# EAGLE design hmi-lisa-encoder (EAGLE 9.6.2)
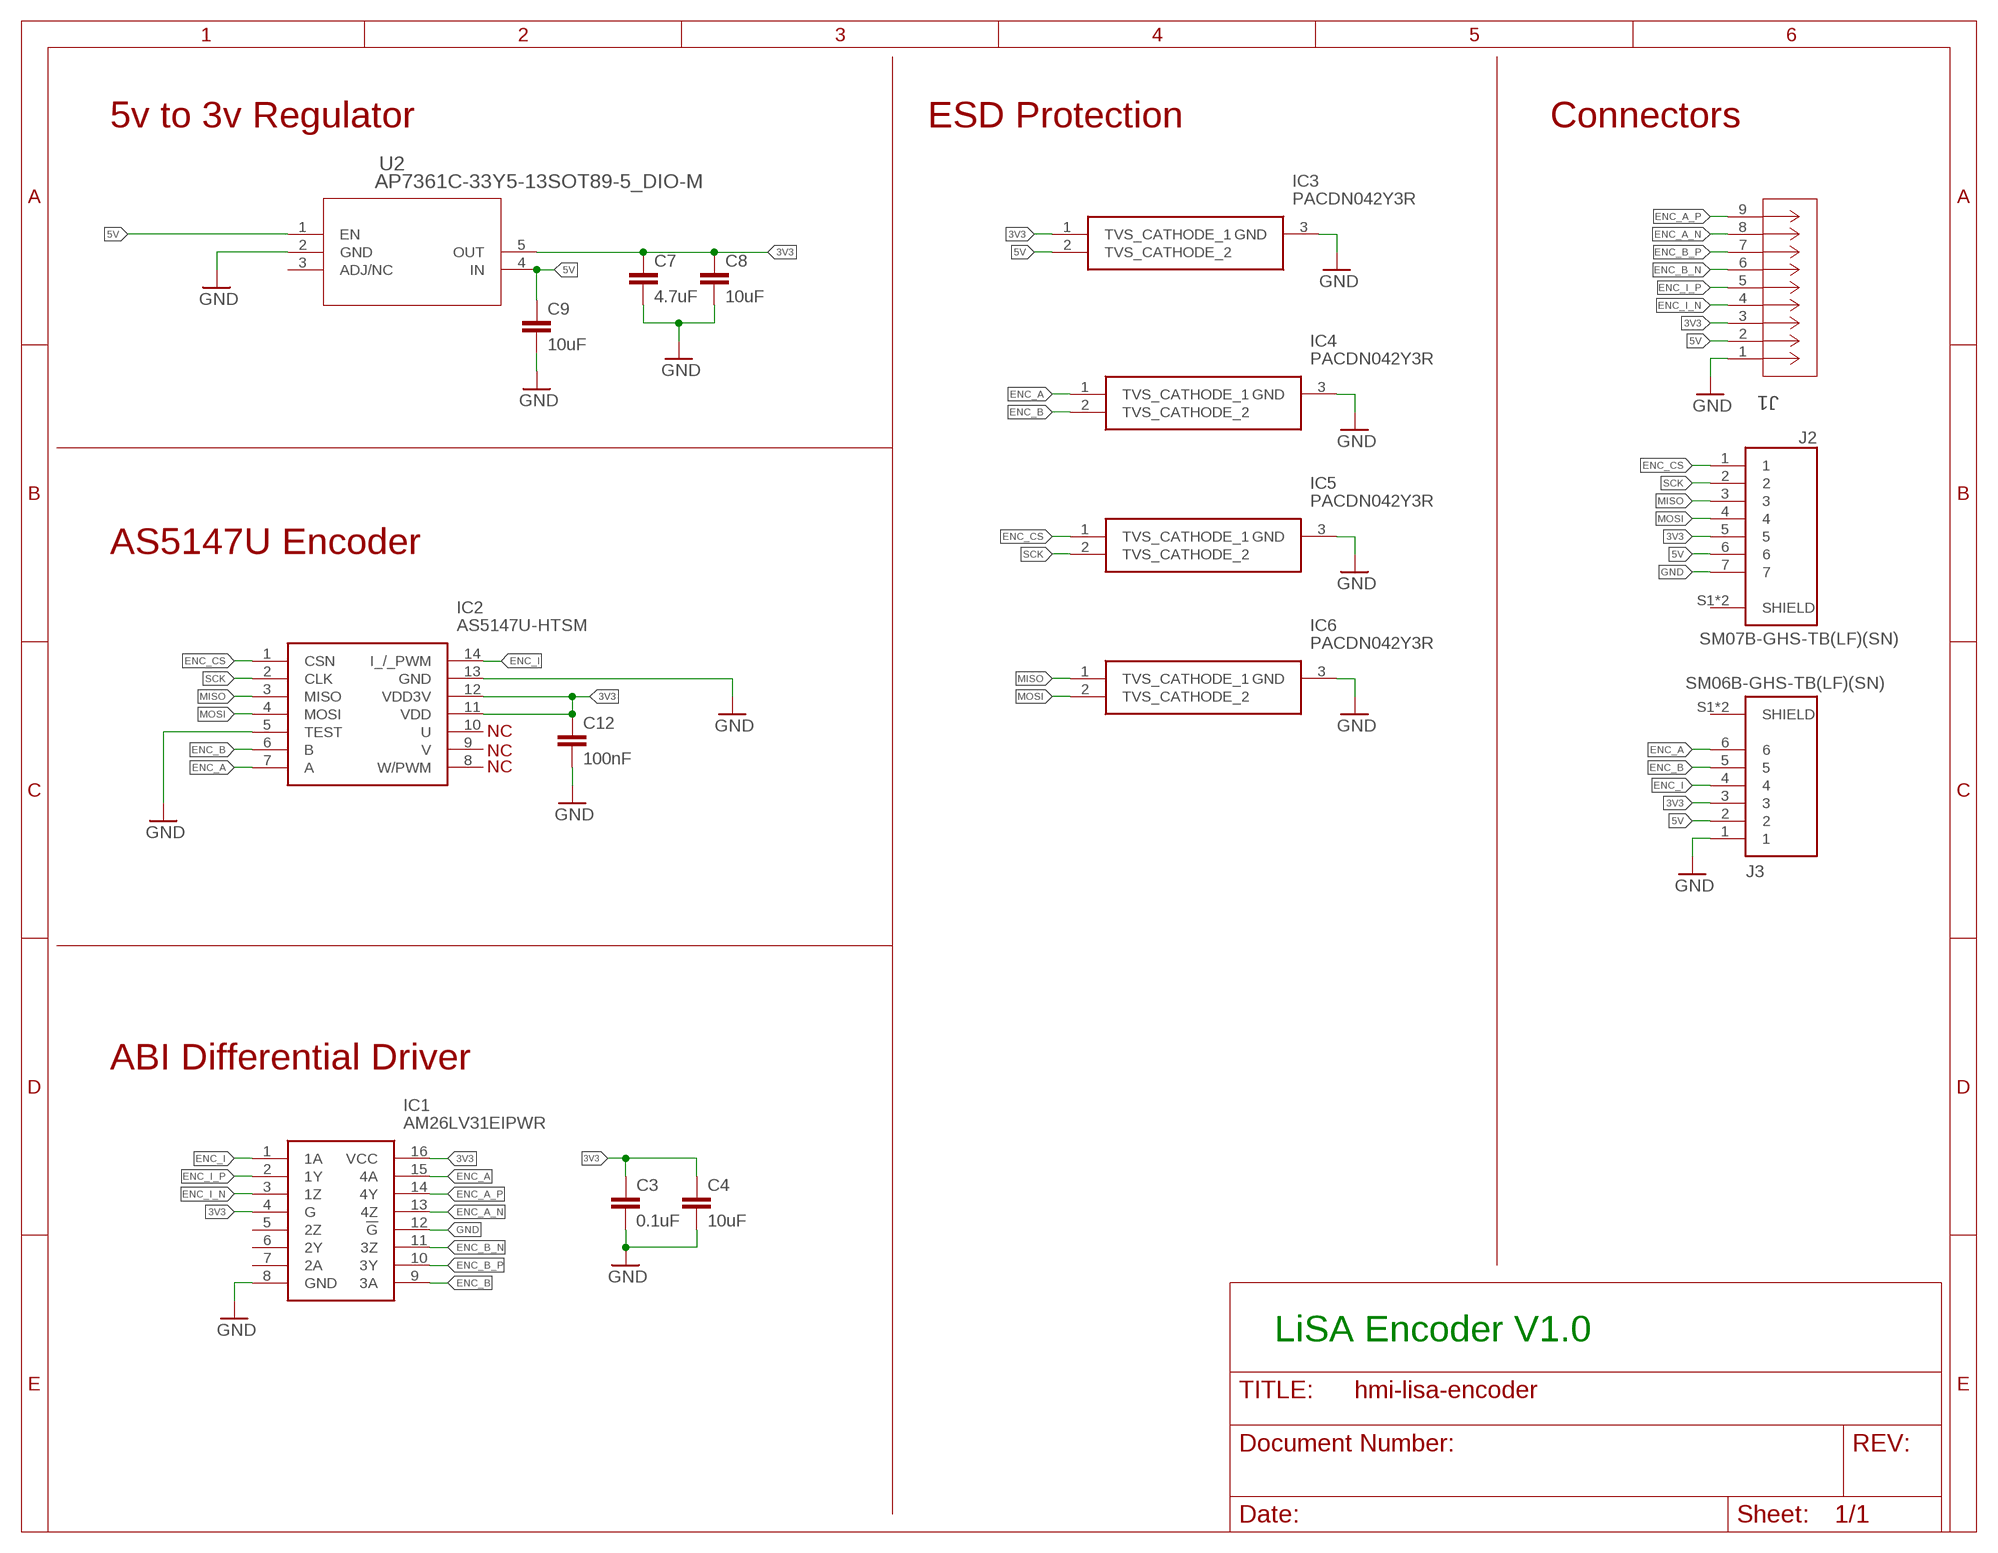
[diagram p0: schematic, sheet 1]

## Parts
C3  0.1uF  C-EUC0603  [C0603]
C4  10uF  C-EUC0603  [C0603]
C7  4.7uF  C-EUC0603  [C0603]
C8  10uF  C-EUC0603  [C0603]
C9  10uF  C-EUC0603  [C0603]
C12  100nF  C-EUC0603  [C0603]
IC1  AM26LV31EIPWR  [SOP65P640X120-16N]
IC2  AS5147U-HTSM  [SOP65P640X120-14N]
IC3  PACDN042Y3R  [SOT96P237X111-3N]
IC4  PACDN042Y3R  [SOT96P237X111-3N]
IC5  PACDN042Y3R  [SOT96P237X111-3N]
IC6  PACDN042Y3R  [SOT96P237X111-3N]
J1  SM09B-GHS-TB(LF)(SN)  [CONN_SM09B-GHS-TB_JST]
J2  SM07B-GHS-TB(LF)(SN)  [JST_SM07B-GHS-TB(LF)(SN)]
J3  SM06B-GHS-TB(LF)(SN)  [JST_SM06B-GHS-TB(LF)(SN)]
U2  AP7361C-33Y5-13SOT89-5_DIO-M  [SOT89-5_DIO-M]

## Nets
3V3: C3.1 C4.1 C7.1 C8.1 C12.1 IC1.4(G) IC1.16(VCC) IC2.11(VDD) IC2.12(VDD3V) IC3.1(TVS_CATHODE_1) J1.3 J2.5 J3.3 U2.5(OUT)
5V: C9.1 IC3.2(TVS_CATHODE_2) J1.2 J2.6 J3.2 U2.1(EN) U2.4(IN)
ENC_A: IC1.15(4A) IC2.7(A) IC4.1(TVS_CATHODE_1) J3.6
ENC_A_N: IC1.13(4Z) J1.8
ENC_A_P: IC1.14(4Y) J1.9
ENC_B: IC1.9(3A) IC2.6(B) IC4.2(TVS_CATHODE_2) J3.5
ENC_B_N: IC1.11(3Z) J1.6
ENC_B_P: IC1.10(3Y) J1.7
ENC_CS: IC2.1(CSN) IC5.1(TVS_CATHODE_1) J2.1
ENC_I: IC1.1(1A) IC2.14(I_/_PWM) J3.4
ENC_I_N: IC1.3(1Z) J1.4
ENC_I_P: IC1.2(1Y) J1.5
GND: C3.2 C4.2 C7.2 C8.2 C9.2 C12.2 IC1.8(GND) IC1.12(!G) IC2.5(TEST) IC2.13(GND) IC3.3(GND) IC4.3(GND) IC5.3(GND) IC6.3(GND) J1.1 J2.7 J3.1 U2.2(GND)
MISO: IC2.3(MISO) IC6.1(TVS_CATHODE_1) J2.3
MOSI: IC2.4(MOSI) IC6.2(TVS_CATHODE_2) J2.4
SCK: IC2.2(CLK) IC5.2(TVS_CATHODE_2) J2.2
Unconnected: IC1.5(2Z) IC1.6(2Y) IC1.7(2A) IC2.8(W/PWM) IC2.9(V) IC2.10(U) J3.S1(SHIELD) J3.S2(SHIELD) U2.3(ADJ/NC)

## Notes on the sheet
- 5v to 3v Regulator | ESD Protection | Connectors
- AS5147U Encoder
- NC
- NC
- NC
- ABI Differential Driver
- LiSA Encoder V1.0

## Power pins joined to a net without a drawn wire
SHIELD: J2.S1(SHIELD) J2.S2(SHIELD)

## Library data of the parts
C3 C4 C7-C9 C12 = rcl:C-EU: CAPACITOR, European symbol; SPICEPREFIX: C
IC1 = AM26LV31EIPWR:AM26LV31EIPWR: Low-Voltage High-Speed Quadruple Differential Line Driver With +/-15-kV IEC ESD Protection Source: Datasheet <http://www.ti.com/lit/gpn/am26lv31e>; ARROW_PART_NUMBER: AM26LV31EIPWR; ARROW_PRICE-STOCK: https://www.arrow.com/en/products/am26lv31eipwr/texas-instruments?region=nac; DESCRIPTION: Low-Voltage High-Speed Quadruple Differential Line Driver With +/-15-kV IEC ESD Protection; HEIGHT: 1.2mm; MANUFACTURER_NAME: Texas Instruments; MANUFACTURER_PART_NUMBER: AM26LV31EIPWR; MOUSER_PART_NUMBER: 595-AM26LV31EIPWR; MOUSER_PRICE-STOCK: https://www.mouser.co.uk/ProductDetail/Texas-Instruments/AM26LV31EIPWR?qs=iW8OfOTwbwMA51JqXL5WTA%3D%3D
IC2 = AS5147U-HTSM:AS5147U-HTSM: Board Mount Hall Effect / Magnetic Sensors 14-Bit Dual-Die On-Axis Magnetic Rotary Position Sensor with Up to 14-Bit Binary Incremental Pulse Count Source: Datasheet <https://ams.com/documents/20143/36005/AS5147_DS000307_3-00.pdf>; ARROW_PART_NUMBER: AS5147U-HTSM; ARROW_PRICE-STOCK: https://www.arrow.com/en/products/as5147u-htsm/ams-ag?region=nac; DESCRIPTION: Board Mount Hall Effect / Magnetic Sensors 14-Bit Dual-Die On-Axis Magnetic Rotary Position Sensor with Up to 14-Bit Binary Incremental Pulse Count; HEIGHT: 1.2mm; MANUFACTURER_NAME: ams; MANUFACTURER_PART_NUMBER: AS5147U-HTSM; MOUSER_PART_NUMBER: 985-AS5147U-HTSM; MOUSER_PRICE-STOCK: https://www.mouser.co.uk/ProductDetail/ams/AS5147U-HTSM?qs=vLWxofP3U2ztCxAO5c%252BNHw%3D%3D
IC3-IC6 = PACDN042Y3R:PACDN042Y3R: Transient Voltage Suppressors and ESD Protectors Source: Datasheet <http://www.onsemi.com/pub/Collateral/PACDN042-D.PDF>; ARROW_PART_NUMBER: PACDN042Y3R; ARROW_PRICE-STOCK: https://www.arrow.com/en/products/pacdn042y3r/on-semiconductor; DESCRIPTION: Transient Voltage Suppressors and ESD Protectors; HEIGHT: 1.11mm; MANUFACTURER_NAME: onsemi; MANUFACTURER_PART_NUMBER: PACDN042Y3R; MOUSER_PART_NUMBER: 748-PACDN042Y3R; MOUSER_PRICE-STOCK: https://www.mouser.co.uk/ProductDetail/onsemi/PACDN042Y3R?qs=XcCBWJCwUGxb%252B%252BFbMKkIDQ%3D%3D
J1 = SM09B-GHS-TB:SM09B-GHS-TB(LF)(SN); COPYRIGHT: Copyright (C) 2023 Ultra Librarian. All rights reserved.; MANUFACTURER_PART_NUMBER: SM09B-GHS-TB(LF)(SN); MFR_NAME: JST
J2 = SM07B-GHS-TB_LF__SN_:SM07B-GHS-TB(LF)(SN): Conn Shrouded Header HDR 7 POS 1.25mm Solder RA SMD Reel; DESCRIPTION: Connector Header Surface Mount, Right Angle 7 position 0.049 (1.25mm); DIGI-KEY_PART_NUMBER: 455-1569-2-ND; MF: JST Sales; MP: SM07B-GHS-TB(LF)(SN); PACKAGE: None; PURCHASE-URL: https://pricing.snapeda.com/search/part/SM07B-GHS-TB(LF)(SN)/?ref=eda
J3 = SM06B-GHS-TB_LF__SN_:SM06B-GHS-TB(LF)(SN): GHS Series 1.25 mm Pitch Disc. Crimp Wire-to-Wire Connector; DESCRIPTION: Connector Header Surface Mount, Right Angle 6 position 0.049 (1.25mm); DIGI-KEY_PART_NUMBER: 455-1568-2-ND; MF: JST Sales; MP: SM06B-GHS-TB(LF)(SN); PACKAGE: None; PURCHASE-URL: https://pricing.snapeda.com/search/part/SM06B-GHS-TB(LF)(SN)/?ref=eda
U2 = AP7361C-33Y5-13:AP7361C-33Y5-13; COPYRIGHT: Copyright (C) 2023 Ultra Librarian. All rights reserved.; MANUFACTURER_PART_NUMBER: AP7361C-33Y5-13; MFR_NAME: Diodes Inc

## Net classes
1 CAN: width 0.152 mm, clearance 0.229 mm

## Board
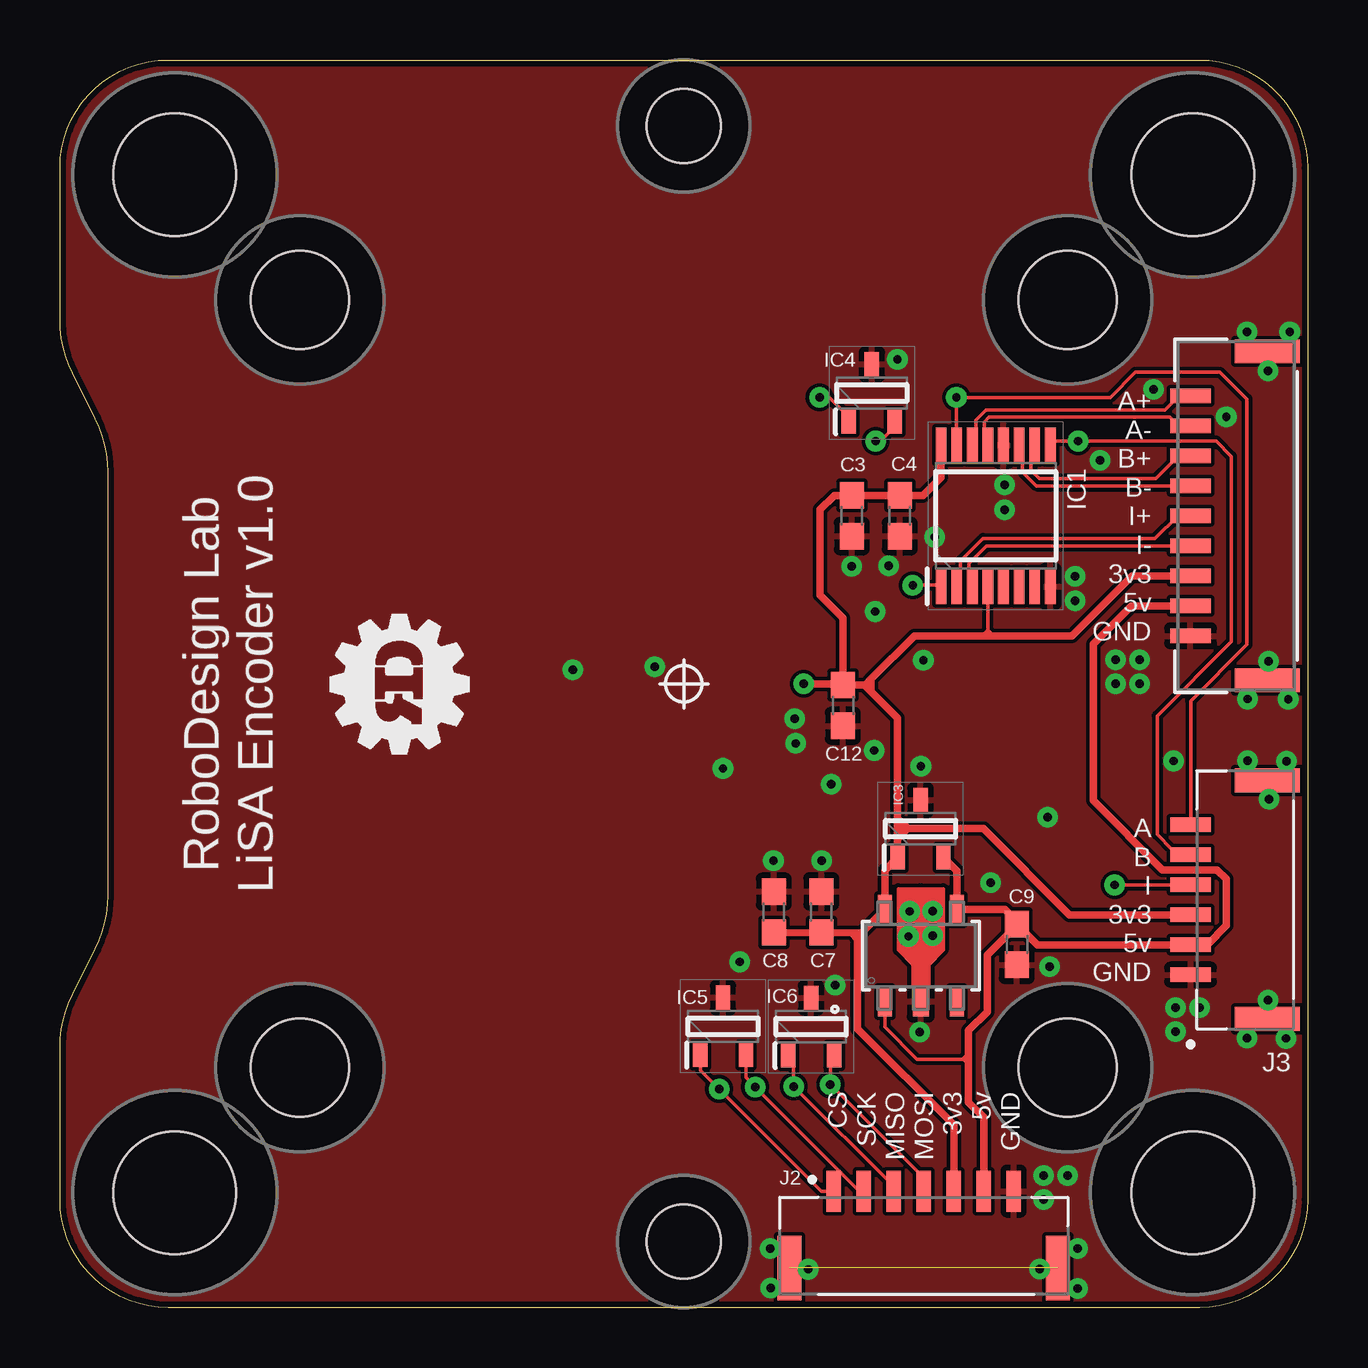
[diagram p1: board, top side]
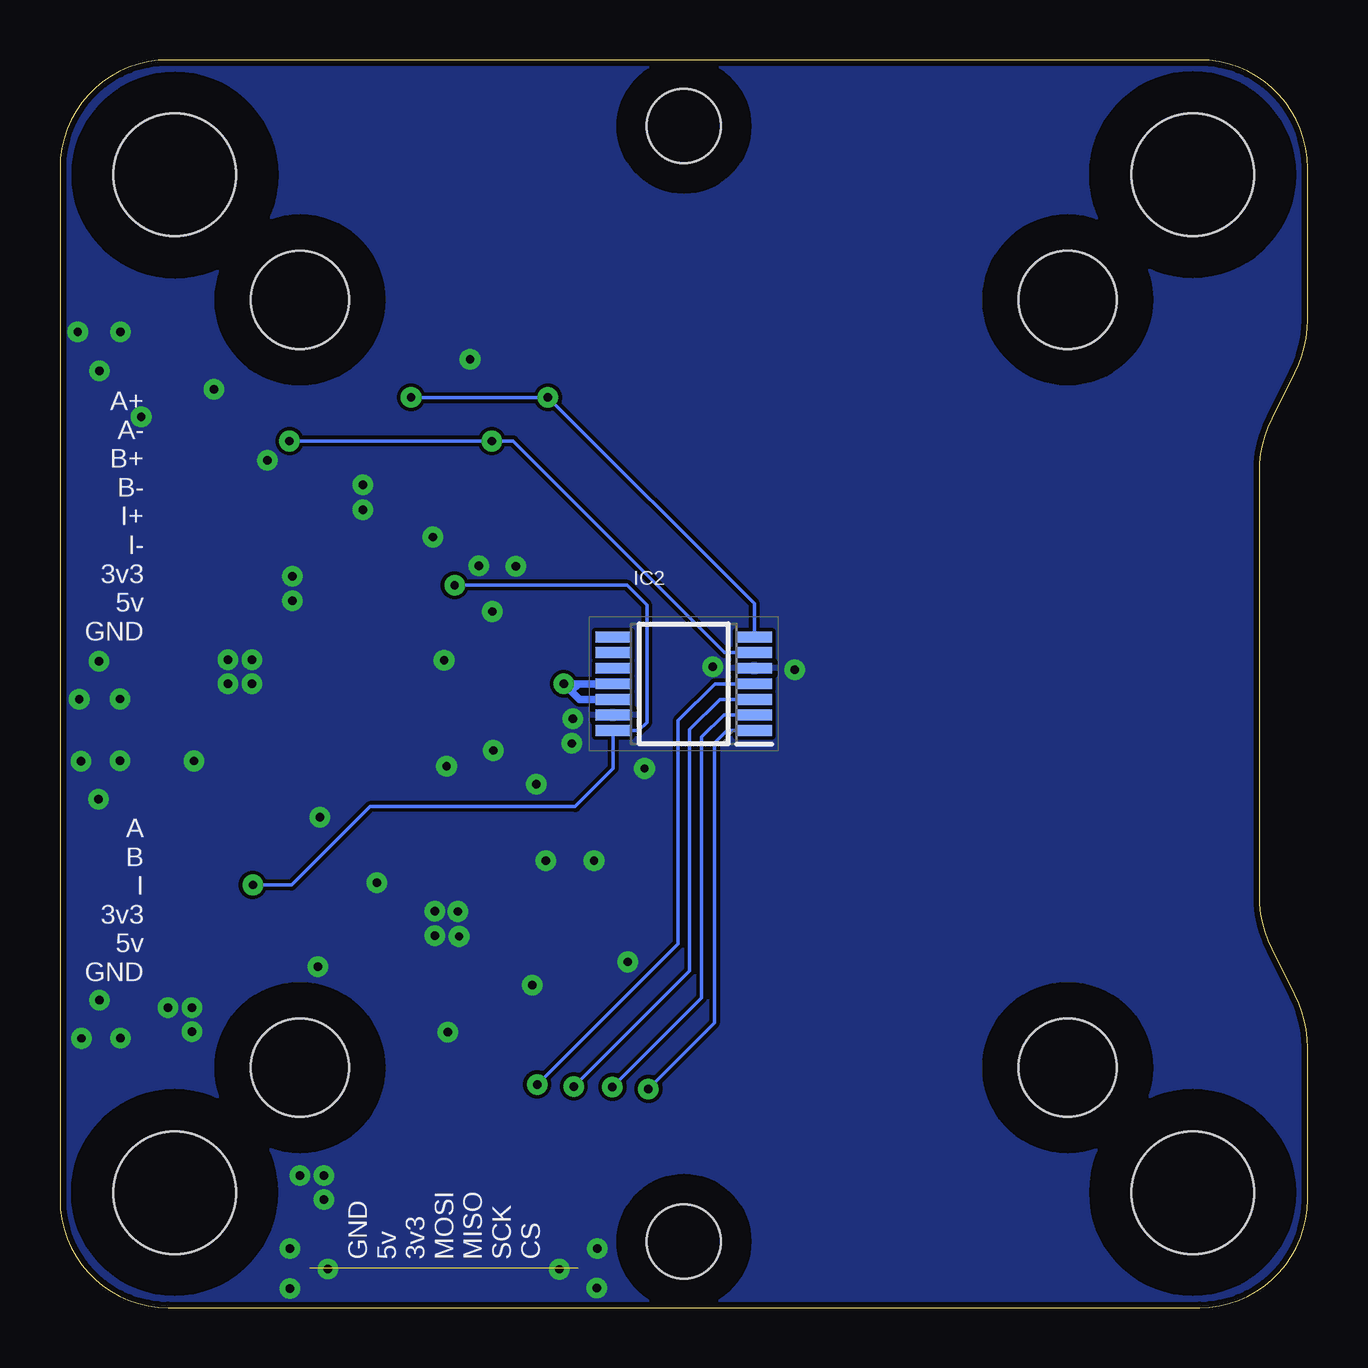
[diagram p2: board, bottom side, seen from below]

Size 52 x 52 mm. Coordinates in mm from the lower left corner, seen from the top.
Outline: 4.5,52 47.5,52 arc-90 52,47.5 52,4.5 arc-90 47.5,0 4.5,0 arc-90 0,4.5 0,10.82 arc-27 0.53,13.06 1.47,14.94 arc27 2,17.18 2,34.82 arc27 1.47,37.06 0.53,38.94 arc-27 0,41.18 0,47.5 arc-90 4.5,52
Copper layers (1*16): Top 0.035mm / dielectric 1.5mm / Bottom 0.035mm
Design rules "Circuitects-Rules *": minimum track width 6mil, minimum drill 0.3mm, track to track 6mil, track to pad 6mil, pad to pad 6mil, via to via 6mil, smd to smd 6mil, copper to edge 10mil, drill to drill 8mil, minimum pad ring 12mil, minimum via ring 10mil, stop-mask expansion 4mil, vias tented up to drill 25mil, thermal gap 10mil
Holes 4.1 mm at 10,42 42,42 42,10 10,10
Holes 3.1 mm at 26,49.25 26,2.75
Holes 5.1 mm at 4.79,47.21 47.21,47.21 47.21,4.79 4.79,4.79
tRestrict: 40 lines
bRestrict: 40 lines

### Footprints (pad centres in the part's own frame; a part is rotated, then mirrored left to right if it is on the bottom)
C0603 = smd 1.1 x 1: 1 -0.85,0; 2 0.85,0
SOP65P640X120-16N = smd 1.475 x 0.45: 1 -2.938,2.275; 2 -2.938,1.625; 3 -2.938,0.975; 4 -2.938,0.325; 5 -2.938,-0.325; 6 -2.938,-0.975; 7 -2.938,-1.625; 8 -2.938,-2.275; 9 2.938,-2.275; 10 2.938,-1.625; 11 2.938,-0.975; 12 2.938,-0.325; 13 2.938,0.325; 14 2.938,0.975; 15 2.938,1.625; 16 2.938,2.275
SOP65P640X120-14N = smd 1.475 x 0.45: 1 -2.938,1.95; 2 -2.938,1.3; 3 -2.938,0.65; 4 -2.938,0; 5 -2.938,-0.65; 6 -2.938,-1.3; 7 -2.938,-1.95; 8 2.938,-1.95; 9 2.938,-1.3; 10 2.938,-0.65; 11 2.938,0; 12 2.938,0.65; 13 2.938,1.3; 14 2.938,1.95
SOT96P237X111-3N = smd 1 x 0.6: 1 -1.2,0.955; 2 -1.2,-0.955; 3 1.2,0
CONN_SM09B-GHS-TB_JST = smd 0.61 x 1.702: 1 -5,1.876; 2 -3.75,1.876; 3 -2.5,1.876; 4 -1.25,1.876; 5 0,1.876; 6 1.25,1.876; 7 2.5,1.876; 8 3.75,1.876; 9 5,1.876 | smd 0.991 x 2.692: 10 -6.85,-1.324; 11 6.85,-1.324
JST_SM07B-GHS-TB(LF)(SN) = smd 0.6 x 1.7: 1 -3.75,1.85; 2 -2.5,1.85; 3 -1.25,1.85; 4 0,1.85; 5 1.25,1.85; 6 2.5,1.85; 7 3.75,1.85 | smd 1 x 2.7: S1 5.6,-1.35; S2 -5.6,-1.35
JST_SM06B-GHS-TB(LF)(SN) = smd 0.6 x 1.7: 1 -3.125,1.875; 2 -1.875,1.875; 3 -0.625,1.875; 4 0.625,1.875; 5 1.875,1.875; 6 3.125,1.875 | smd 1 x 2.7: S1 -4.975,-1.325; S2 4.975,-1.325
SOT89-5_DIO-M = smd 0.583 x 1.24: 1 -1.5,-1.915; 3 1.5,-1.915; 4 1.5,1.915; 5 -1.5,1.915 | smd 0.66 x 1.24: 2 0,-1.915

### Placement (x,y rotation side)
C3  33,33 270 top
C4  35,33 270 top
C7  31.73,16.49 90 top
C8  29.76,16.48 90 top
C9  39.88,15.13 270 top
C12  32.63,25.1 270 top
IC1  39,33 90 top
IC2  26,26 180 bottom
IC3  35.87,19.95 90 top
IC4  33.84,38.12 90 top
IC5  27.64,11.72 90 top
IC6  31.31,11.71 90 top
J1  49,33 90 top
J2  36,3 0 top
J3  49,17 90 top
U2  35.88,14.67 0 top

### Tracks (layer width: path | path; a pad name or v marks a point on that pad's centre or on a via)
3V3  (via drill 0.35)
  Top 0.152: 38.67,28.25 IC1.4 | 38.43,28 38.67,28.25 | 38.67,28.25 38.92,28
  Top 0.305: v31,26 32.58,26 | 32.58,26 C12.1 | 33.41,15.62 U2.5 34.38,18.22 IC3.1 34.91,19.55 | 33.41,15.62 33.24,15.62 | 33.24,15.62 33,15.62 | 33,15.62 C7.1 29.9,15.62 C8.1 | 34.91,19.96 34.91,20.38 | 34.91,20.38 34.91,24.56 33.8,25.67 | IC1.16 36.73,34.6 35.97,33.85 C4.1 C3.1 32.28,33.85 31.69,33.26 31.69,29.69 32.63,28.75 32.63,26.05 32.58,26 | J2.5 37.25,7.61 33.24,11.61 33.24,15.37 | 33.24,15.37 33.24,15.45 | 33.24,15.45 33.24,15.62 | 33,15.62 33.24,15.37 | 33.24,15.45 33.41,15.61 33.41,15.62 | J3.3 42.08,16.38 38.49,19.96 35.33,19.96 | 34.91,19.55 34.91,19.96 | 34.91,19.96 35.33,19.96 | 35.33,19.96 | 35.33,19.96 34.91,20.38 | 35.33,19.96 34.92,19.55 34.91,19.55 | J1.3 44.67,30.5 42.17,28 38.92,28 38.43,28 35.62,28 33.81,26.19 | C12.1 | 33.81,26.19 33.81,25.67 33.8,25.67 | 33.81,26.19 33.56,25.95 | 33.56,25.95 C12.1 | 33.8,25.67 33.56,25.91 33.56,25.95
  Bottom 0.305: IC2.12 30.35,25.35 30.69,25.69 | 30.39,26 30.69,25.69 | IC2.11 30.39,26 | 30.69,25.69 v31,26 30.39,26
5V
  Top 0.152: U2.1 34.38,11.69 35.72,10.35 37.64,10.35 | 37.64,10.35 37.87,10.35 | 37.64,10.35 37.64,10.36 | 37.64,10.36 37.87,10.58 | 37.64,10.36 37.87,10.13 37.87,10.11
  Top 0.305: IC3.2 37.38,18.2 U2.4 39.38,16.59 39.88,16.08 C9.1 40.09,15.79 40.08,15.78 | 40.08,15.78 39.91,15.95 38.65,14.69 38.65,12.32 37.87,11.54 37.87,10.58 37.87,10.35 37.87,10.11 37.87,8.55 38.5,7.92 J2.6 | 40.08,15.78 40.73,15.12 J3.2 47.82,15.12 48.61,15.92 48.61,17.86 48.23,18.25 45.95,18.25 43.07,21.13 43.07,27.66 44.66,29.25 J1.2
ENC_A  (via drill 0.35)
  Top 0.152: IC1.15 37.36,35.95 v37.36,37.94 43.77,37.94 44.82,38.99 48.35,38.99 49.47,37.87 49.47,27.63 47.12,25.28 J3.6 | IC4.1 32.88,37.12 32.06,37.94 v31.66,37.94
  Bottom 0.152: IC2.7 23.06,29.34 v31.66,37.94 v37.36,37.94
ENC_A_N
  Top 0.152: IC1.13 38.53,36.09 38.53,36.91 38.73,37.11 46.26,37.11 46.61,36.75 J1.8
ENC_A_P
  Top 0.152: IC1.14 38.17,36.09 38.17,36.98 38.6,37.41 46.05,37.41 46.64,38 J1.9
ENC_B  (via drill 0.35)
  Top 0.152: IC1.9 41.45,36.12 v42.43,36.12 48.19,36.12 48.83,35.48 48.83,27.76 45.73,24.66 45.73,19.71 46.34,19.1 46.9,19.1 J3.5 | v34,36.12 34.2,36.12 34.79,36.71 IC4.2
  Bottom 0.152: v42.43,36.12 v34,36.12 33.11,36.12 24.29,27.3 IC2.6
ENC_B_N
  Top 0.152: IC1.11 40.12,35.79 40.12,34.83 40.7,34.25 J1.6
ENC_B_P
  Top 0.152: IC1.10 40.47,35.78 40.47,34.91 40.83,34.56 45.68,34.56 46.62,35.5 J1.7
ENC_CS  (via drill 0.35)
  Top 0.152: J2.1 31.74,4.85 v27.48,9.11 v27.47,9.11 26.7,9.88 26.7,10.51 IC5.1
  Bottom 0.152: IC2.1 24.2,24.05 24.73,23.52 24.73,11.85 v27.47,9.11 v27.48,9.11
ENC_I  (via drill 0.35)
  Top 0.152: v35.55,30.11 36.68,30.11 IC1.1 | v43.97,17.61 J3.4
  Bottom 0.152: v35.55,30.11 28.36,30.11 27.54,29.28 27.54,24.39 27.88,24.05 IC2.14 28.94,22.47 30.53,20.88 39.07,20.88 42.34,17.61 v43.97,17.61
ENC_I_N
  Top 0.152: IC1.3 37.88,30.21 37.88,31 38.62,31.75 J1.4
ENC_I_P
  Top 0.152: IC1.2 37.53,30.22 37.53,31.12 38.47,32.06 45.64,32.06 46.59,33 J1.5
GND  (via drill 0.35)
  other vias: 35.84,11.48 41,4.5 42,5.5 41,5.5 46.5,12.5 47.5,12.5 46.5,11.5 45,27 44,27 44,26 45,26 42.32,30.48 39.38,34.3 39.37,33.25 33.01,30.9 34.54,30.91 36.47,32.12 30.62,24.55 30.67,23.51 33.94,23.22 21.38,26.58 24.79,26.71 29.74,18.63 31.74,18.62 35.42,16.51 36.38,16.52 36.37,15.5 35.37,15.47 35.88,22.56 35.99,26.98 33.98,29.01 32.15,21.81 27.64,22.47 38.8,17.71 41.17,20.44 42.42,2.46 42.41,0.79 29.6,2.46 29.62,0.81 49.48,11.22 51.1,11.22 51.13,22.77 49.5,22.79 51.2,25.35 49.49,25.37 49.48,40.67 51.26,40.67 31.19,1.59 40.83,1.6 50.35,12.82 50.4,21.19 50.38,26.94 50.36,39.04 42.31,29.45 41.24,14.22 28.34,14.41 32.31,13.44 34.91,39.52 43.36,35.32 45.58,38.28 48.61,37.13 46.42,22.78
  pour Top (rank 5): 1.75,53 51.75,53 52.75,52 52.75,1 50.5,-1.25 2.75,-1.25 -1.5,3 -1.5,49.75
  pour Bottom (rank 5): 2.5,53.25 49.5,53.25 53.5,49.25 53.5,1.5 51,-1 2.25,-1 -1.75,3 -1.75,49
MISO  (via drill 0.35)
  Top 0.152: J2.3 34.75,5.04 v30.58,9.21 30.58,10.28 IC6.1
  Bottom 0.152: IC2.3 24.49,25.35 25.75,24.08 25.75,14.03 v30.57,9.21 v30.58,9.21
MOSI  (via drill 0.35)
  Top 0.152: J2.4 36,5.4 v32.11,9.3 32.11,10.35 IC6.2
  Bottom 0.152: IC2.4 24.71,26 26.24,24.47 26.24,15.16 v32.1,9.3 v32.11,9.3
SCK  (via drill 0.35)
  Top 0.152: J2.2 33.32,4.85 v28.98,9.19 28.91,9.25 28.91,9.29 28.6,9.6 IC5.2
  Bottom 0.152: IC2.2 24.33,24.7 25.25,23.77 25.25,12.91 v28.98,9.19
SHIELD  (1 unrouted)

### Text on the board
tPlace: A+ / A- / B+ / B- / I+ / I- / 3v3 / 5v / GND | RoboDesign Lab / LiSA Encoder v1.0 | A / B / I / 3v3 / 5v / GND | CS / SCK / MISO / MOSI / 3v3 / 5v / GND
bPlace: A+ / A- / B+ / B- / I+ / I- / 3v3 / 5v / GND | A / B / I / 3v3 / 5v / GND | GND / 5v / 3v3 / MOSI / MISO / SCK / CS